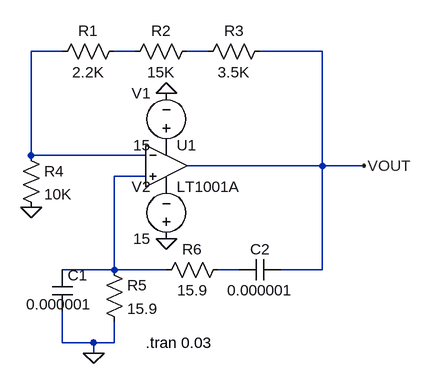
[diagram p0: schematic Wein Bridge Sine Waveform Generator.asc]
Wein Bridge Sine Waveform Generator.asc, the LTspice schematic file:
Version 4
SHEET 1 880 680
WIRE 16 80 -32 80
WIRE 128 80 96 80
WIRE 240 80 208 80
WIRE 416 80 320 80
WIRE -32 240 -32 80
WIRE 144 240 -32 240
WIRE 416 256 416 80
WIRE 416 256 208 256
WIRE 480 256 416 256
WIRE 144 272 96 272
WIRE 96 416 96 272
WIRE 96 416 16 416
WIRE 176 416 96 416
WIRE 288 416 256 416
WIRE 416 416 416 256
WIRE 416 416 352 416
WIRE 16 528 16 480
WIRE 64 528 16 528
WIRE 96 528 96 496
WIRE 96 528 64 528
WIRE 64 544 64 528
FLAG -32 320 0
FLAG 176 144 0
FLAG 176 368 0
FLAG 64 544 0
FLAG 480 256 VOUT
SYMBOL res 112 64 R90
WINDOW 0 0 56 VBottom 2
WINDOW 3 32 56 VTop 2
SYMATTR InstName R1
SYMATTR Value 2.2K
SYMBOL res 224 64 R90
WINDOW 0 0 56 VBottom 2
WINDOW 3 32 56 VTop 2
SYMATTR InstName R2
SYMATTR Value 15K
SYMBOL res 336 64 R90
WINDOW 0 0 56 VBottom 2
WINDOW 3 32 56 VTop 2
SYMATTR InstName R3
SYMATTR Value 3.5K
SYMBOL OpAmps\\LT1001A 176 192 R0
SYMATTR InstName U1
SYMBOL voltage 176 240 R180
WINDOW 0 24 96 Left 2
WINDOW 3 24 16 Left 2
WINDOW 123 0 0 Left 0
WINDOW 39 0 0 Left 0
SYMATTR InstName V1
SYMATTR Value 15
SYMBOL voltage 176 384 R180
WINDOW 0 24 96 Left 2
WINDOW 3 24 16 Left 2
WINDOW 123 0 0 Left 0
WINDOW 39 0 0 Left 0
SYMATTR InstName V2
SYMATTR Value 15
SYMBOL res -48 224 R0
SYMATTR InstName R4
SYMATTR Value 10K
SYMBOL cap 0 416 R0
WINDOW 3 -40 53 Left 2
SYMATTR Value 0.000001
SYMATTR InstName C1
SYMBOL cap 352 400 R90
WINDOW 0 0 32 VBottom 2
WINDOW 3 32 32 VTop 2
SYMATTR InstName C2
SYMATTR Value 0.000001
SYMBOL res 80 400 R0
SYMATTR InstName R5
SYMATTR Value 15.9
SYMBOL res 272 400 R90
WINDOW 0 0 56 VBottom 2
WINDOW 3 32 56 VTop 2
SYMATTR InstName R6
SYMATTR Value 15.9
TEXT 144 528 Left 2 !.tran 0.03

The netlist it stands for:
* Wein Bridge Sine Waveform Generator.asc
R1 N002 N001 2.2K
R2 N003 N002 15K
R3 VOUT N003 3.5K
XU1 N004 N001 P001 P002 VOUT LT1001  ; LT1001A, pins In+ In- V+ V- OUT
V1 P001 0 15
V2 0 P002 15
R4 N001 0 10K
C1 N004 0 0.000001
C2 VOUT N005 0.000001
R5 N004 0 15.9
R6 N005 N004 15.9
.tran 0.03
.lib LTC.lib
.backanno
.end